# EAGLE design PCB-REMCON-ER (EAGLE 7.3.0)
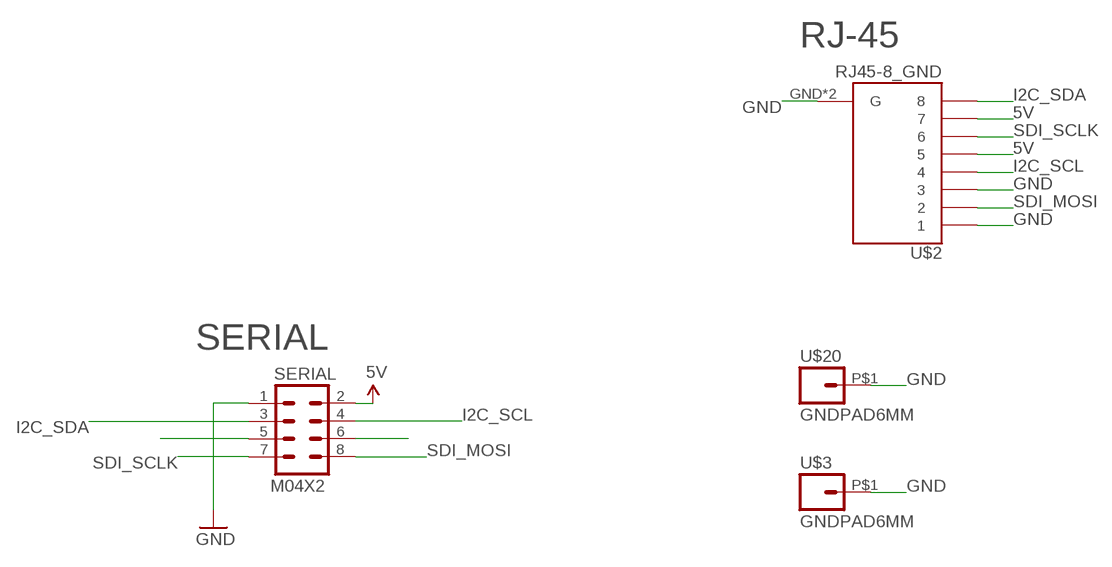
[diagram p0: schematic, sheet 1]

## Parts
SERIAL  M04X2  [2X4]
U$2  RJ45-8_GND  [RJ45-8_GND]
U$3  GNDPAD6MM  [3.2MMPAD6MM]
U$20  GNDPAD6MM  [3.2MMPAD6MM]

## Nets
5V [Power]: SERIAL.2 U$2.5 U$2.7
GND [Power]: SERIAL.1 U$2.1 U$2.3 U$2.GND1(G) U$2.GND(G) U$3.P$1 U$20.P$1
I2C_SCL: SERIAL.4 U$2.4
I2C_SDA [Power]: SERIAL.3 U$2.8
N$4: SERIAL.6
N$5: SERIAL.5
SDI_MOSI: SERIAL.8 U$2.2
SDI_SCLK: SERIAL.7 U$2.6

## Notes on the sheet
- RJ-45
- SERIAL

## Library data of the parts
SERIAL = SparkFun:M04X2
U$2 = SKAARHOJ:RJ45-8_GND
U$3 U$20 = SKAARHOJ:GNDPAD

## Net classes
0 default: width 0.203 mm, drill 0.406 mm, clearance 0.203 mm
1 Power: width 0.406 mm, drill 0.61 mm, clearance 0.203 mm

## Board
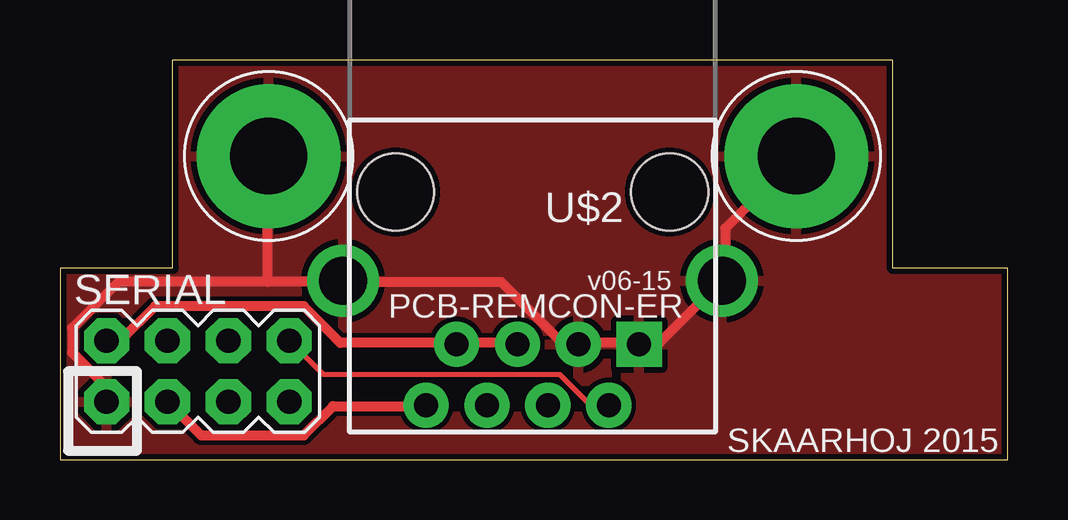
[diagram p1: board, top side]
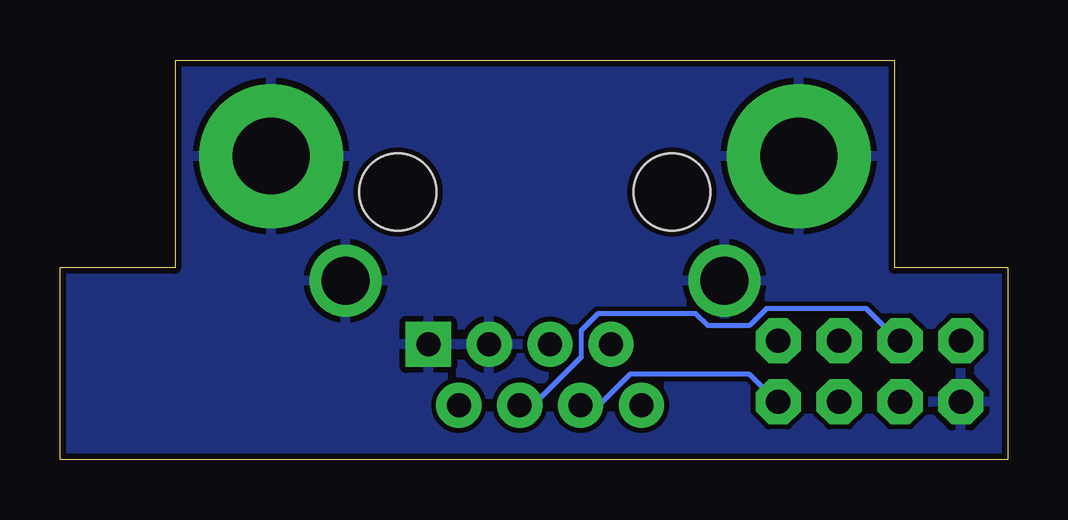
[diagram p2: board, bottom side, seen from below]

Size 39.5 x 16.66 mm. Coordinates in mm from the lower left corner, seen from the top.
Outline: 0,8 0,0 39.5,0 39.5,8 34.7,8 34.7,16.66 4.7,16.66 4.7,8 0,8
Copper layers (1*16): Top 0.035mm / dielectric 1.5mm / Bottom 0.035mm
Design rules "Fusion_eagle_rule_v1.1": minimum track width 6mil, minimum drill 12mil, track to track 6mil, track to pad 6mil, pad to pad 6mil, via to via 6mil, smd to smd 0mil, copper to edge 10mil, drill to drill 10mil, minimum pad ring 10mil, minimum via ring 6mil, stop-mask expansion 2mil, vias tented up to drill 100mil, thermal gap 10mil

### Footprints (pad centres in the part's own frame; a part is rotated, then mirrored left to right if it is on the bottom)
2X4 = drill 1.016 pad 1.88 octagon: 1 -3.81,-1.27; 2 -3.81,1.27; 3 -1.27,-1.27; 4 -1.27,1.27; 5 1.27,-1.27; 6 1.27,1.27; 7 3.81,-1.27; 8 3.81,1.27
RJ45-8_GND = drill 1 pad 1.88 square: 1 -4.445,6.35 | drill 1 pad 1.88: 2 -3.175,8.89; 3 -1.905,6.35; 4 -0.635,8.89; 5 0.635,6.35; 6 1.905,8.89; 7 3.175,6.35; 8 4.445,8.89 | drill 2: GND -7.9,3.7; GND1 7.9,3.7 | hole 3.2: -5.715,0; 5.715,0
3.2MMPAD6MM = drill 3.2 pad 6: P$1 0,0

### Placement (x,y rotation side)
SERIAL  5.75,3.69 0 top
U$2  19.7,11.16 180 top
U$3  30.7,12.66 0 top
U$20  8.7,12.66 0 top

### Tracks (layer width: path | path; a pad name or v marks a point on that pad's centre or on a via)
5V
  Top 0.406: U$2.5 19,4.88 16.56,4.88 U$2.7 16.36,4.88 11.68,4.88 10.16,6.4 3.96,6.4 2.54,4.98 2.03,4.98 SERIAL.2
GND
  Top 0.406: U$3.P$1 30.68,12.6 27.74,9.65 27.74,7.62 U$2.GND 27.53,7.42 24.99,4.88 24.28,4.88 U$2.1 24.08,4.88 21.64,4.88 U$2.3 21.44,4.88 20.93,4.88 18.39,7.42 11.99,7.42 U$2.GND1 11.79,7.42 8.64,7.42 | 8.64,7.42 2.44,7.42 0.51,5.49 0.51,4.47 1.93,3.05 1.93,2.44 SERIAL.1 | 8.64,7.42 8.64,12.6 U$20.P$1
  pour Top: 0,0 40,0 40,17 0,17
  pour Bottom: 0,0 40,0 40,17 0,17
I2C_SCL
  Bottom 0.203: U$2.4 20.32,2.34 19.71,2.34 17.78,4.27 17.78,5.38 17.07,6.1 13.01,6.1 12.5,5.59 10.77,5.59 10.06,6.3 5.89,6.3 4.57,4.98 SERIAL.4
I2C_SDA
  Top 0.406: U$2.8 15.24,2.23 11.38,2.23 10.16,1.02 5.89,1.02 4.57,2.34 SERIAL.3
SDI_MOSI
  Top 0.203: U$2.2 22.86,2.34 22.05,2.34 20.83,3.56 10.97,3.56 9.65,4.88 SERIAL.8
SDI_SCLK
  Bottom 0.203: U$2.6 17.78,2.34 16.97,2.34 15.75,3.56 10.77,3.56 9.65,2.44 SERIAL.7

### Text on the board
_tsilk: v06-15 | PCB-REMCON-ER | SKAARHOJ 2015